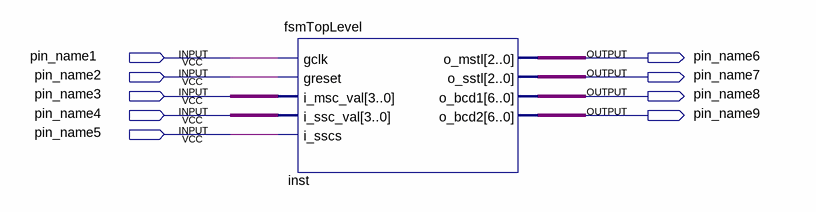
[diagram p0: schematic sheet]
// Quartus schematic trafficLightController.bdf as structural Verilog: 1 symbols, 9 pins
module trafficLightController (
  input  pin_name1,
  input  pin_name2,
  input  pin_name3,
  input  pin_name4,
  input  pin_name5,
  output pin_name6,
  output pin_name7,
  output pin_name8,
  output pin_name9
);

  wire [2:0] inst_o_mstl, inst_o_sstl;
  wire [3:0] undriven, undriven_2;
  wire [6:0] inst_o_bcd1, inst_o_bcd2;

  fsmTopLevel inst (
    .gclk(pin_name1), .greset(pin_name2), .i_msc_val(undriven), .i_ssc_val(undriven_2), .i_sscs(pin_name5),
    .o_mstl(inst_o_mstl), .o_sstl(inst_o_sstl), .o_bcd1(inst_o_bcd1), .o_bcd2(inst_o_bcd2));
endmodule
